# EAGLE schematic Winch (EAGLE 7.3.0)
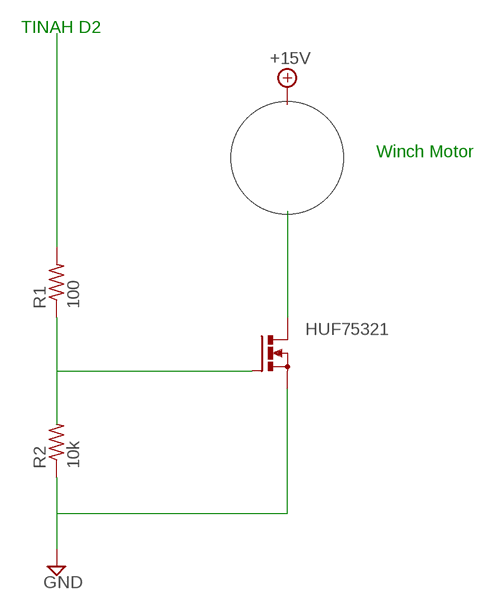
[diagram p0: schematic, sheet 1]

## Parts
HUF75321  N-MOSFET-SO8S  [SO-08]
R1  100  R-US_0204/2V  [0204V]
R2  10k  R-US_0204/2V  [0204V]

## Nets
GND: HUF75321.1(S) HUF75321.2(S) HUF75321.3(S) R2.1
N$1: R1.2
N$2: HUF75321.4(G) R1.1 R2.2
N$3: HUF75321.5(D) HUF75321.6(D) HUF75321.7(D) HUF75321.8(D)

## Notes on the sheet
- TINAH D2
- Winch Motor

## Library data of the parts
HUF75321 = transistor-power:N-MOSFET-SO8: N-Channel MOSFET Example: FDS7760A; N-Channel Logic Level PowerTrench® MOSFET FDS2572; N-Channel UltraFET® Trench MOSFET Source: www.fairchildsemi.com
R1 R2 = resistor:R-US_: RESISTOR, American symbol